# Altium schematic sheet sheet.SchDoc
size A4
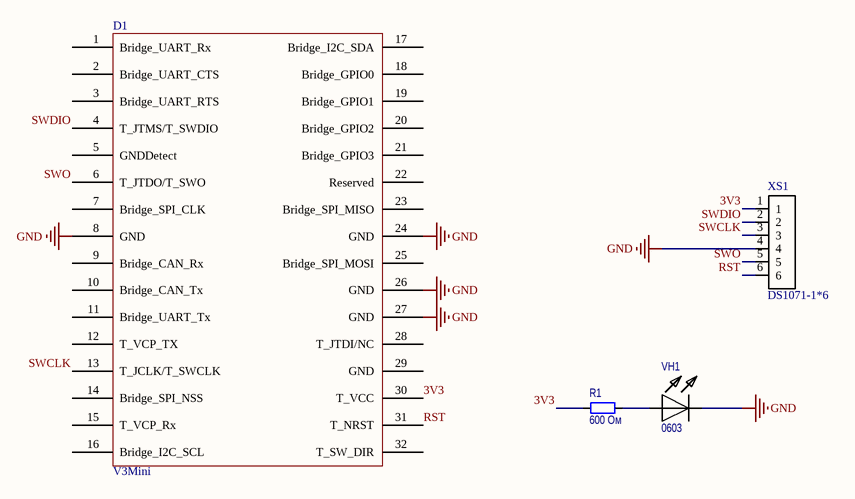
[diagram p0: sheet.SchDoc]

## Parts
D1  V3Mini  [STV3Mini]
R1  600 Ом  [0805]
VH1  0603  [led_0603]
XS1  DS1071-1*6  [PBS-6R]

## Nets
GND: D1.8(GND) D1.24(GND) D1.26(GND) D1.27(GND) VH1.1(Cathode) XS1.4
3V3: D1.30(T_VCC) R1.1 XS1.1
RST: D1.31(T_NRST) XS1.6
SWCLK: D1.13(T_JCLK/T_SWCLK) XS1.3
SWDIO: D1.4(T_JTMS/T_SWDIO) XS1.2
SWO: D1.6(T_JTDO/T_SWO) XS1.5
NetR1_2: R1.2 VH1.2(Anode)

Not connected (* = marked no-connect by the designer): D1 1(Bridge_UART_Rx) 2(Bridge_UART_CTS) 3(Bridge_UART_RTS) 5(GNDDetect) 7(Bridge_SPI_CLK) 9(Bridge_CAN_Rx) 10(Bridge_CAN_Tx) 11(Bridge_UART_Tx) 12(T_VCP_TX) 14(Bridge_SPI_NSS) 15(T_VCP_Rx) 16(Bridge_I2C_SCL) 17(Bridge_I2C_SDA) 18(Bridge_GPIO0) 19(Bridge_GPIO1) 20(Bridge_GPIO2) 21(Bridge_GPIO3) 22(Reserved) 23(Bridge_SPI_MISO) 25(Bridge_SPI_MOSI) 28(T_JTDI/NC) 29(GND) 32(T_SW_DIR)

## Library data of the parts
R1 = RESISTOR: NameBom: Резистор  600 Ом; Value: 600 Ом
VH1 = led: NameBom: TO-1608BC-MRE; Package: 0603; Part Number: TO-1608BC-MRE
XS1 = PBS-6(DS1023-1*6): 6 pin 1 row socket; value: DS1071-1*6